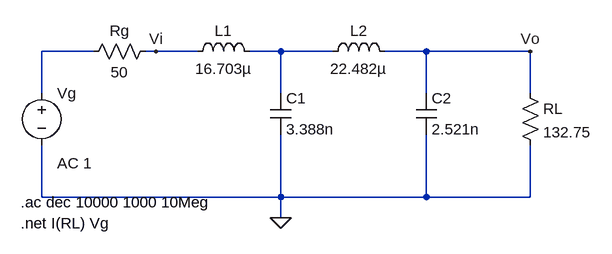
[diagram p0: schematic Circuito_50.asc]
Circuito_50.asc, the LTspice schematic file:
Version 4
SHEET 1 932 680
WIRE 96 96 16 96
WIRE 192 96 176 96
WIRE 256 96 192 96
WIRE 384 96 336 96
WIRE 464 96 384 96
WIRE 608 96 544 96
WIRE 768 96 608 96
WIRE 16 160 16 96
WIRE 384 160 384 96
WIRE 608 160 608 96
WIRE 768 160 768 96
WIRE 16 320 16 240
WIRE 384 320 384 224
WIRE 384 320 16 320
WIRE 608 320 608 224
WIRE 608 320 384 320
WIRE 768 320 768 240
WIRE 768 320 608 320
WIRE 384 352 384 320
FLAG 384 352 0
FLAG 768 96 Vo
FLAG 192 96 Vi
SYMBOL voltage 16 144 R0
WINDOW 123 24 124 Left 2
WINDOW 39 0 0 Left 0
SYMATTR Value2 AC 1
SYMATTR InstName Vg
SYMATTR Value ""
SYMBOL res 192 80 R90
WINDOW 0 0 56 VBottom 2
WINDOW 3 32 56 VTop 2
SYMATTR InstName Rg
SYMATTR Value 50
SYMBOL ind 240 112 R270
WINDOW 0 32 56 VTop 2
WINDOW 3 5 56 VBottom 2
SYMATTR InstName L1
SYMATTR Value 16.703µ
SYMBOL cap 368 160 R0
SYMATTR InstName C1
SYMATTR Value 3.388n
SYMBOL ind 448 112 R270
WINDOW 0 32 56 VTop 2
WINDOW 3 5 56 VBottom 2
SYMATTR InstName L2
SYMATTR Value 22.482µ
SYMBOL cap 592 160 R0
SYMATTR InstName C2
SYMATTR Value 2.521n
SYMBOL res 752 144 R0
SYMATTR InstName RL
SYMATTR Value 132.75
TEXT -16 328 Left 2 !.ac dec 10000 1000 10Meg
TEXT -16 360 Left 2 !.net I(RL) Vg

The netlist it stands for:
* Circuito_50.asc
Vg N001 0 AC 1
Rg Vi N001 50
L1 Vi N002 16.703µ
C1 N002 0 3.388n
L2 N002 Vo 22.482µ
C2 Vo 0 2.521n
RL Vo 0 132.75
.ac dec 10000 1000 10Meg
.net I(RL) Vg
.backanno
.end